# Altium schematic sheet SchematicDraft.SchDoc
size A4
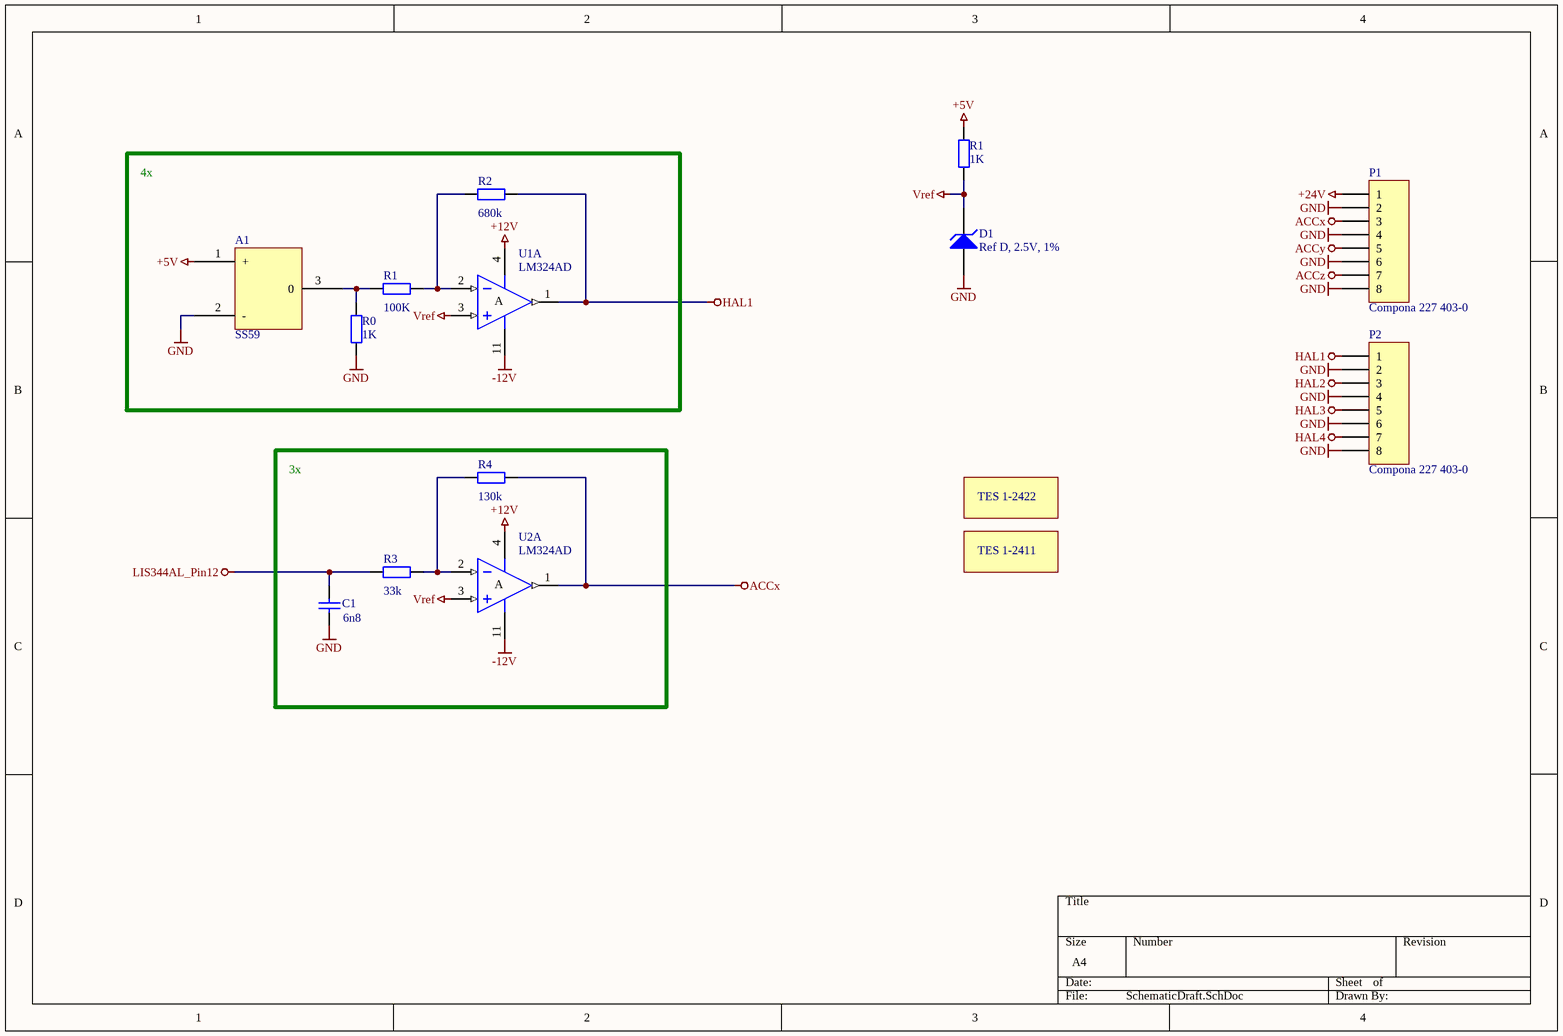
[diagram p0: SchematicDraft.SchDoc]

## Parts
(Parts that share a designator on the sheet are numbered #1, #2 ... from top to bottom, then left to right.)
A1  SS59  [SOT89M]
C1  value 6n8  [1206]  (hidden comment: Cap)
D1  Ref D, 2.5V, 1%  [DIODE-0.7]
P1  Compona 227 403-0  [HDR1X8]
P2  Compona 227 403-0  [HDR1X8]
R0  value 1K  [1206]  (hidden comment: R)
R1#1  value 1K  [1206]  (hidden comment: R)
R1#2  value 100K  [1206]  (hidden comment: R)
R2  value 680k  [1206]  (hidden comment: R)
R3  value 33k  [1206]  (hidden comment: R)
R4  value 130k  [1206]  (hidden comment: R)
U1  LM324AD  [SO14_N]  (part A of 4)
U2  LM324AD  [SO14_N]  (part A of 4)

## Blocks framed on the sheet
4x: A1 R0 R1#2 R2 U1
3x: C1 R3 R4 U2

## Nets
+5V: A1.1(+) R1#1.1
+12V: U1.4(V+) U2.4(V+)
+24V: P1.1
-12V: U1.11(V-) U2.11(V-)
ACCx: P1.3 R4.2 U2.1(OUT)
ACCy: P1.5
ACCz: P1.7
GND: A1.2(-) C1.1 D1.1(A) P1.2 P1.4 P1.6 P1.8 P2.2 P2.4 P2.6 P2.8 R0.1
HAL1: P2.1 R2.2 U1.1(OUT)
HAL2: P2.3
HAL3: P2.5
HAL4: P2.7
LIS344AL_Pin12: C1.2 R3.1
Vref: D1.2(K) R1#1.2 U1.3(IN+) U2.3(IN+)
NetA1_3: A1.3(0) R0.2 R1#2.1
NetR1#2_2: R1#2.2 R2.1 U1.2(IN-)
NetR3_2: R3.2 R4.1 U2.2(IN-)

## Notes on the sheet
- TES 1-2422
- TES 1-2411
- (in symbol LM324AD, part A) A

## Library data of the parts
C1 = Cap: Capacitor; Published: 8-Jun-2000; LatestRevisionDate: 17-Jul-2002; LatestRevisionNote: Re-released for DXP Platform.; PackageReference: RAD-0.3; Publisher: Altium Limited
D1 = D Zener: Zener Diode; Published: 8-Jun-2000; LatestRevisionDate: 17-Jul-2002; LatestRevisionNote: Re-released for DXP Platform.; PackageReference: DIODE-0.7; Publisher: Altium Limited; PackageDescription: Diode, Thru-Hole; 2 Leads; 0.7 in Pin Spacing
P1 P2 = Header 8: Header, 8-Pin; LatestRevisionDate: 17-Jul-2002; LatestRevisionNote: Re-released for DXP Platform.; Publisher: Altium Limited
R0 R1#1 R1#2 R2-R4 = Resitor: Resistor; Published: 8-Jun-2000; LatestRevisionDate: 17-Jul-2002; LatestRevisionNote: Re-released for DXP Platform.; PackageReference: AXIAL-0.4; Publisher: Altium Limited
U1 U2 = LM324AD: Low-Power Quad Operational Amplifier; Published: 24-Aug-2001; LatestRevisionDate: 13-Apr-2006; LatestRevisionNote: IPC-7351 Footprint Added.; DatasheetVersion: Nov-1997; PackageVersion: Sep-1998; PackageReference: SO14; Publisher: Altium Limited; PackageDescription: 14-Pin Small Outline Integrated Circuit 1.27 mm Pitch; Code_IPC: SOIC127P600-14; ComponentLink1Description: Manufacturer Link; ComponentLink1URL: http://www.st.com/; ComponentLink2Description: Datasheet; ComponentLink2URL: http://www.st.com/stonline/products/literature/ds/4797/lm224a.pdf